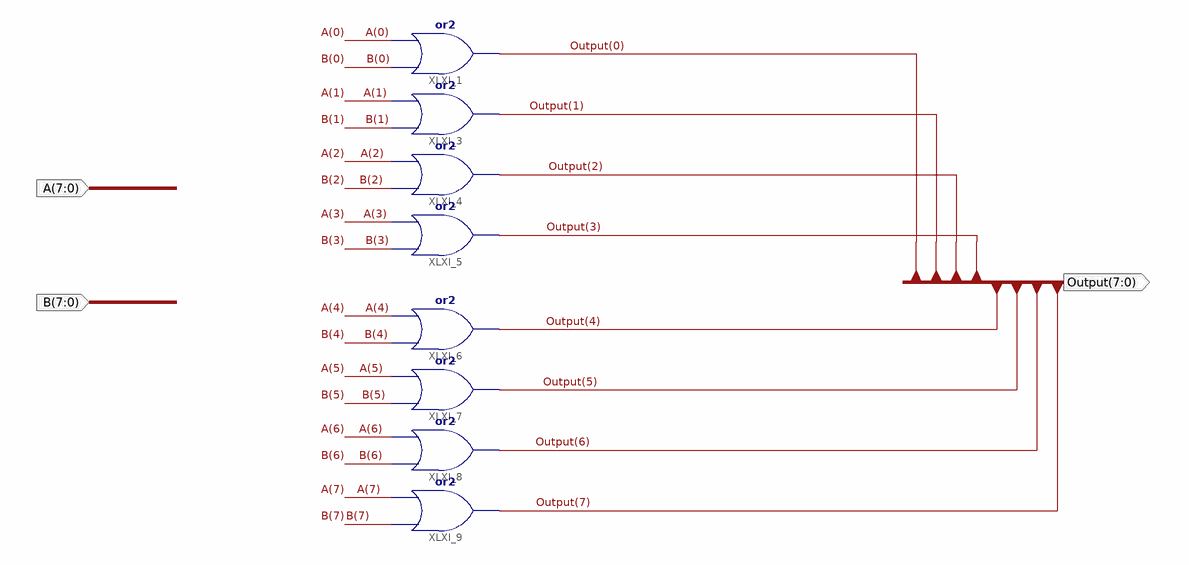
[diagram p0: schematic sheet 1]
// Xilinx ISE schematic proj1OR8to8.sch (spartan6) as structural Verilog: 8 symbols, 3 ports
module proj1OR8to8 (
  input  [7:0] A,
  input  [7:0] B,
  output [7:0] Output
);

  or XLXI_1 (Output[0], B[0], A[0]);
  or XLXI_3 (Output[1], B[1], A[1]);
  or XLXI_4 (Output[2], B[2], A[2]);
  or XLXI_5 (Output[3], B[3], A[3]);
  or XLXI_6 (Output[4], B[4], A[4]);
  or XLXI_7 (Output[5], B[5], A[5]);
  or XLXI_8 (Output[6], B[6], A[6]);
  or XLXI_9 (Output[7], B[7], A[7]);
endmodule
